# EAGLE schematic BrushlessLamp (EAGLE 9.6.2)
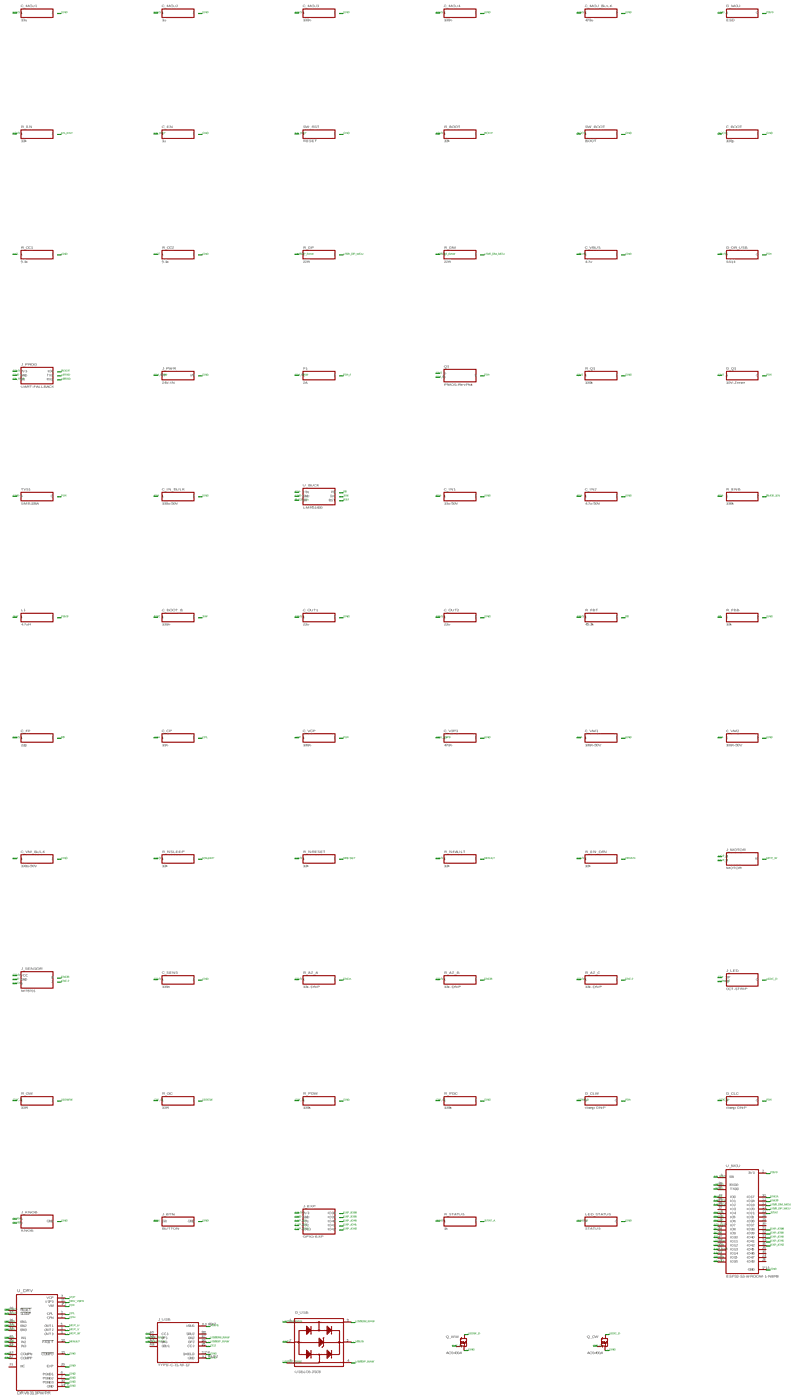
[diagram p0: schematic, sheet 1, overview]
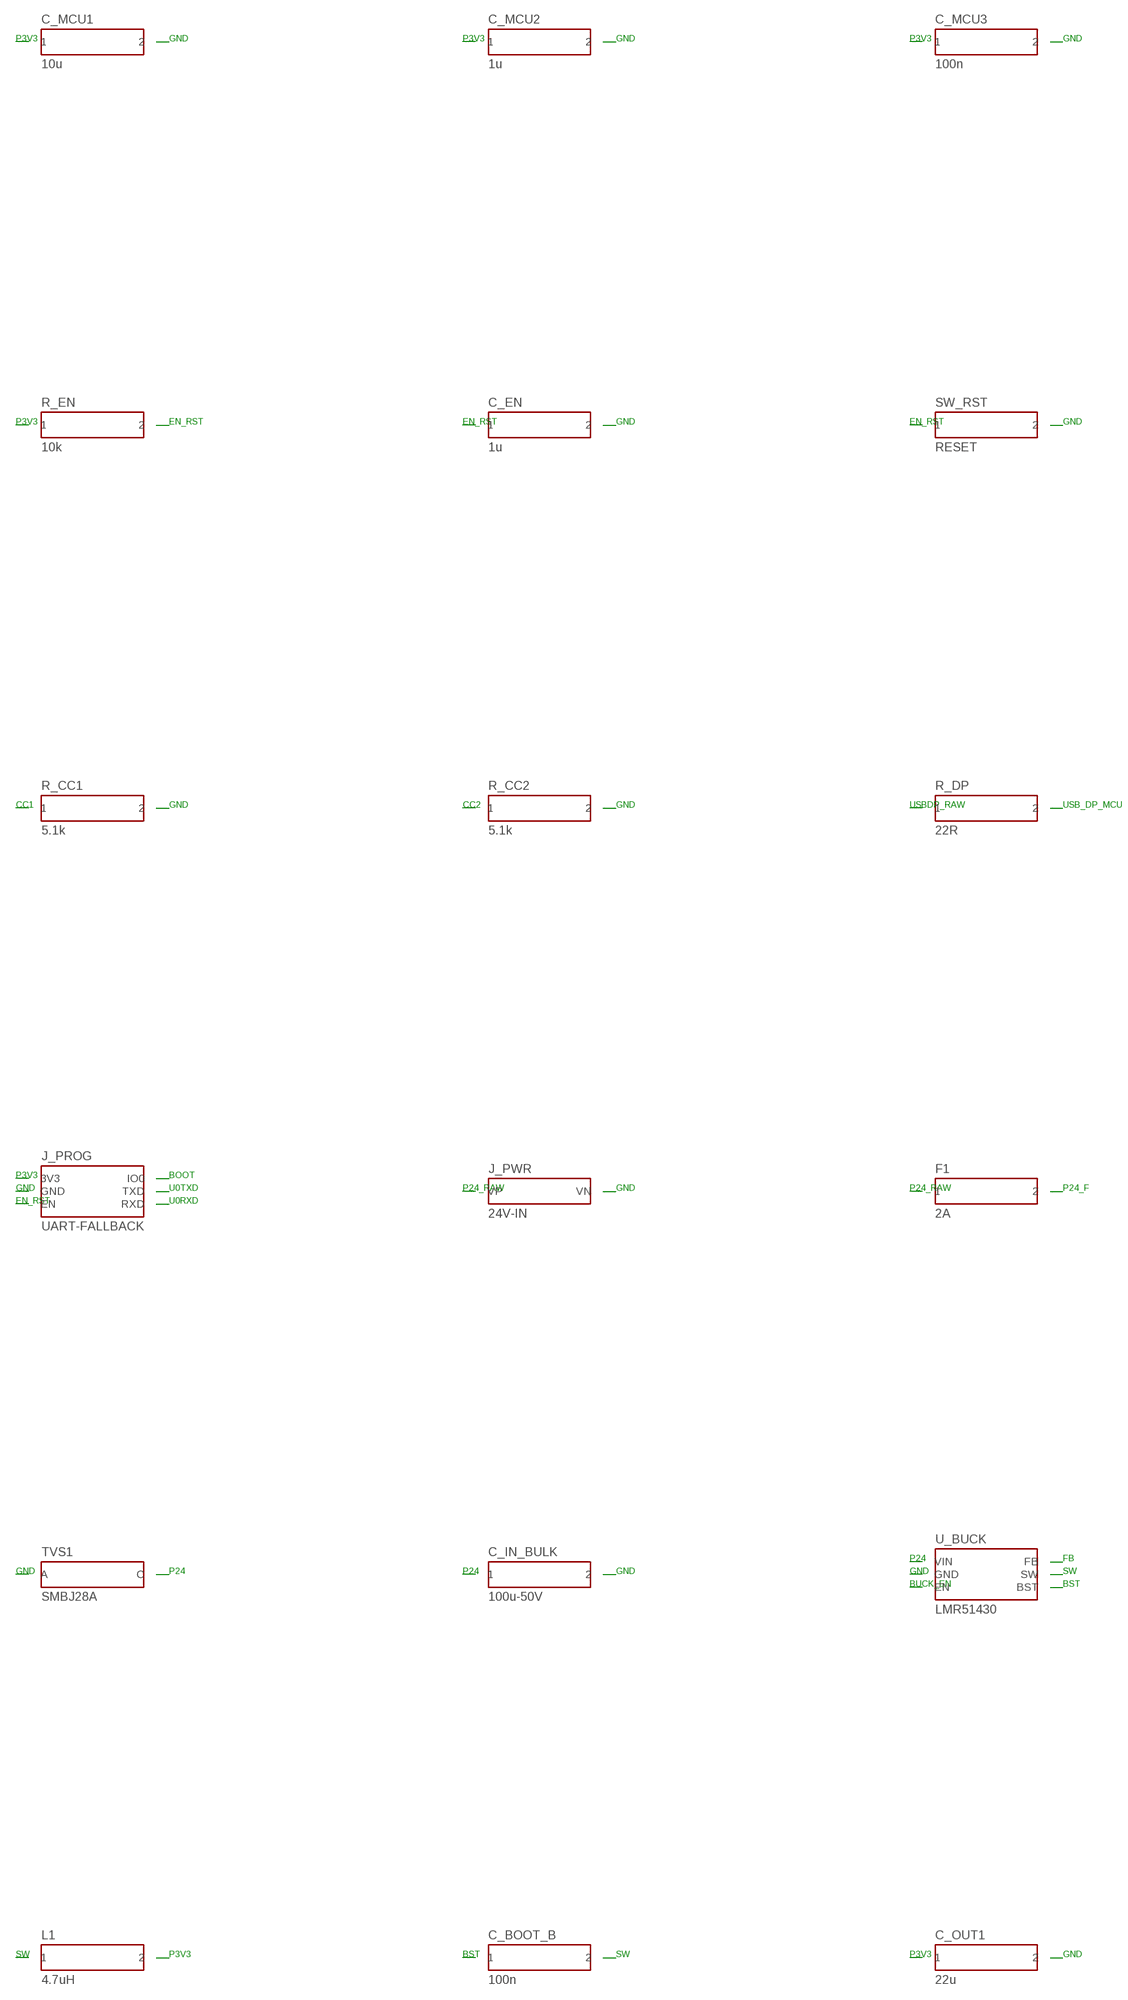
[diagram p1: schematic, sheet 1, part 1 of 4]
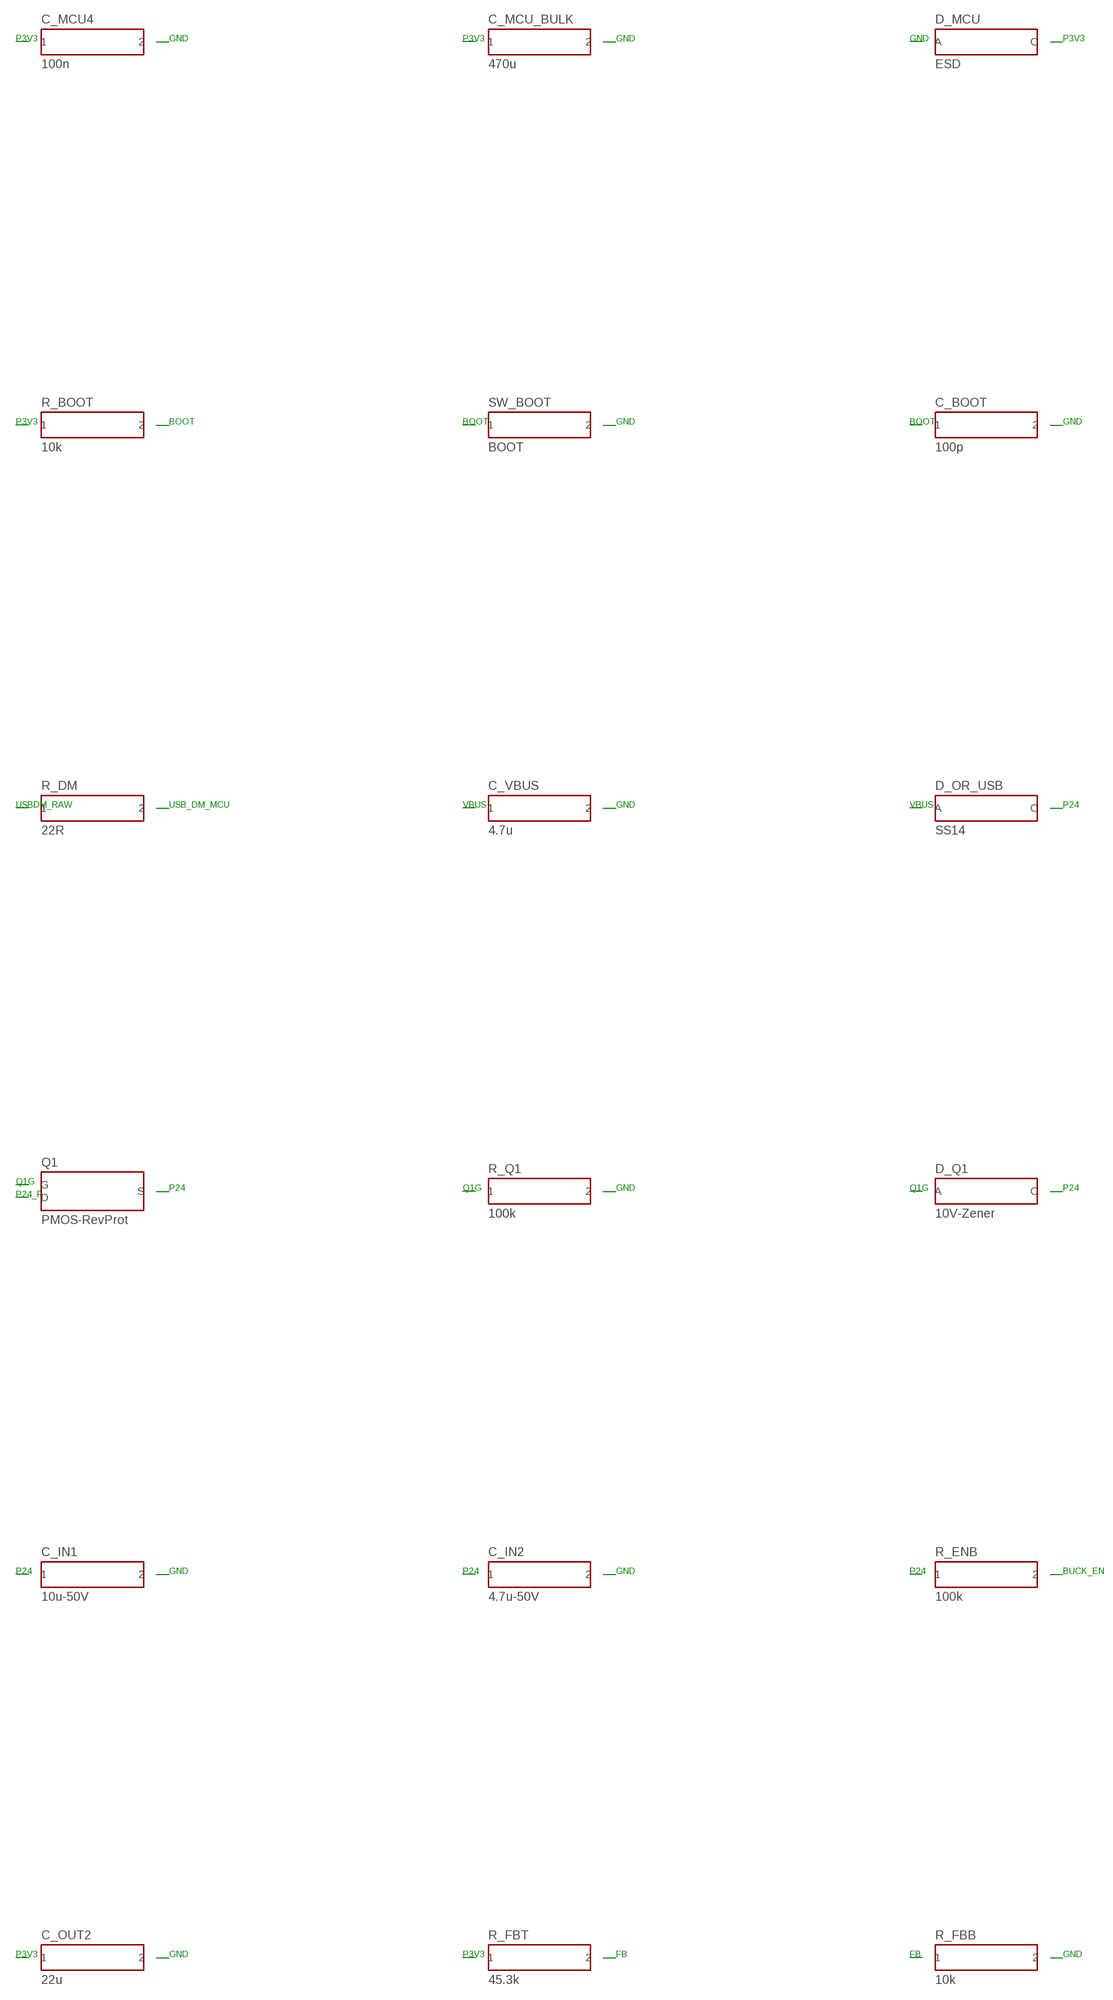
[diagram p2: schematic, sheet 1, part 2 of 4]
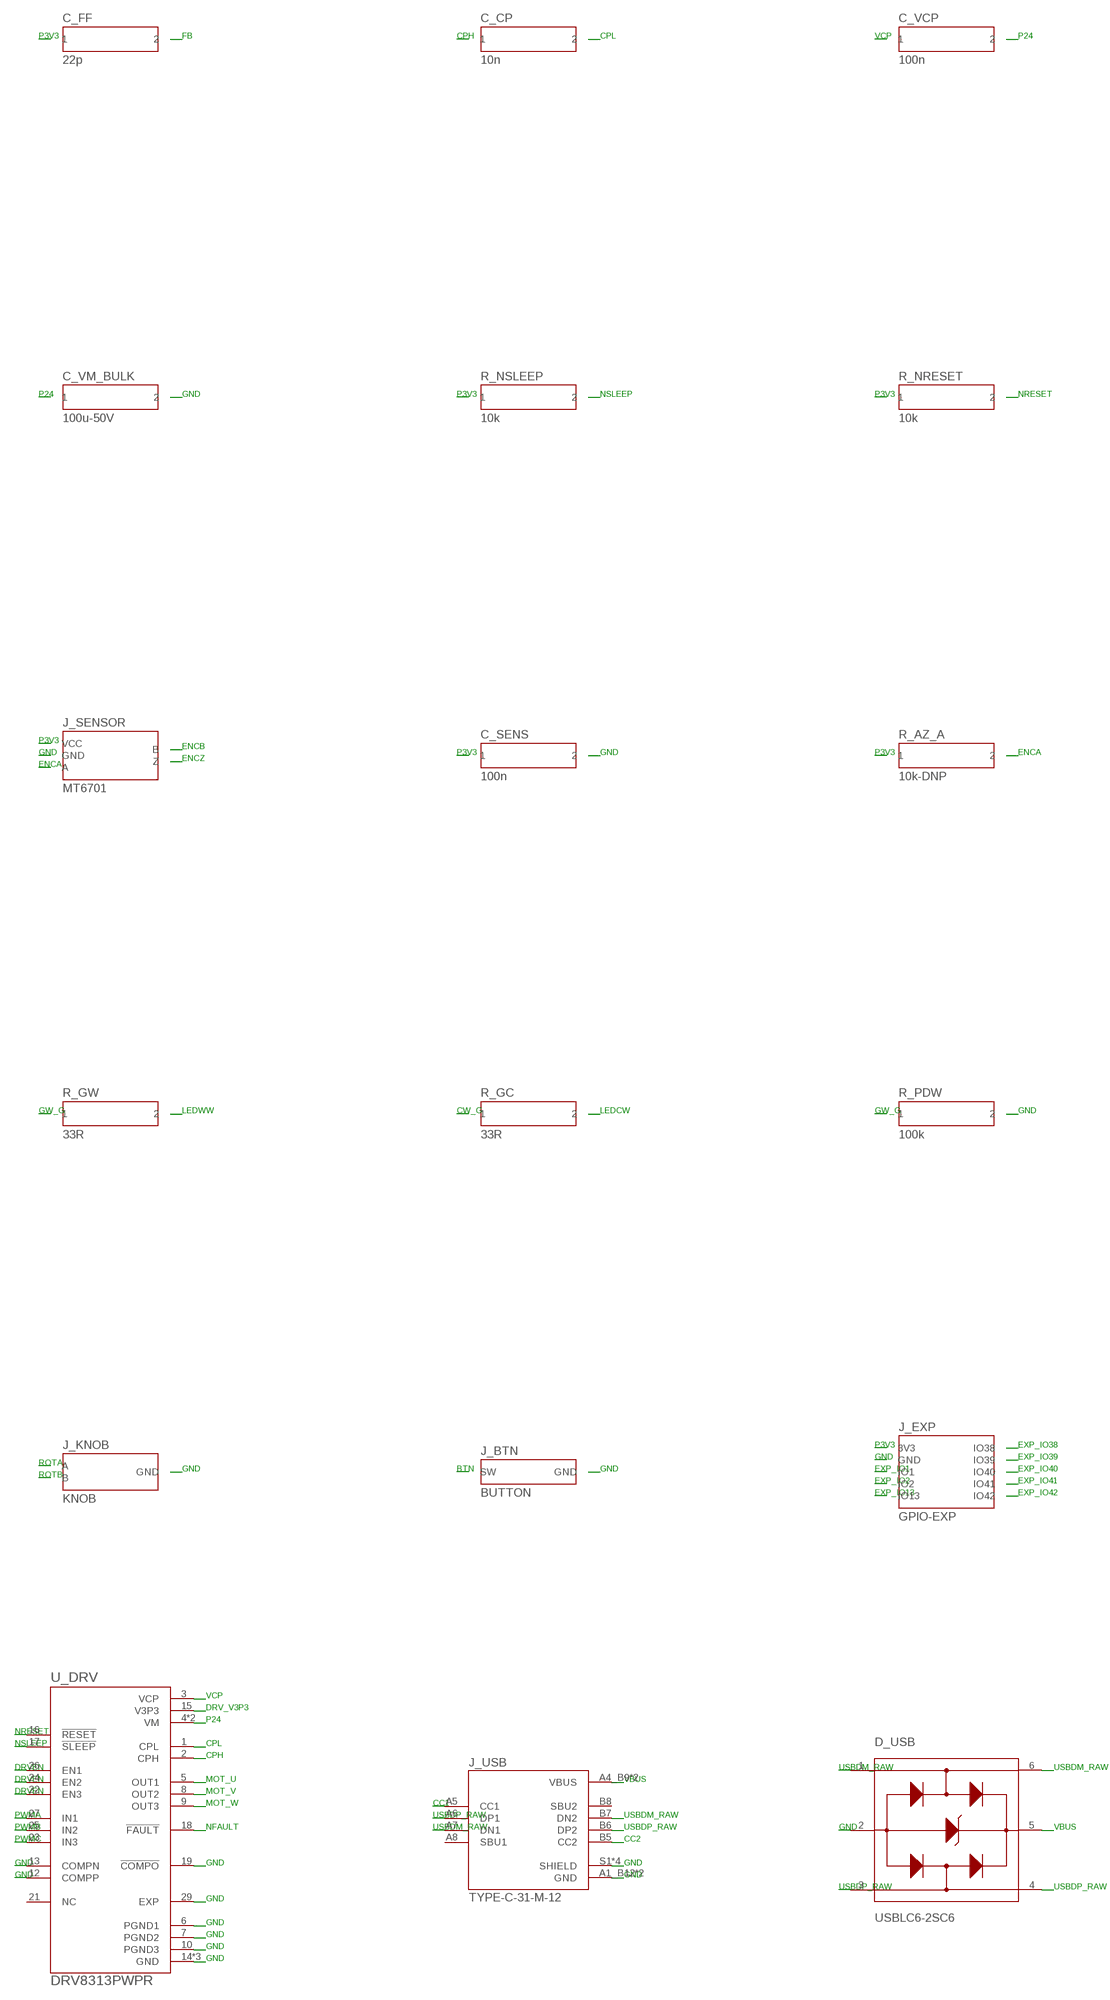
[diagram p3: schematic, sheet 1, part 3 of 4]
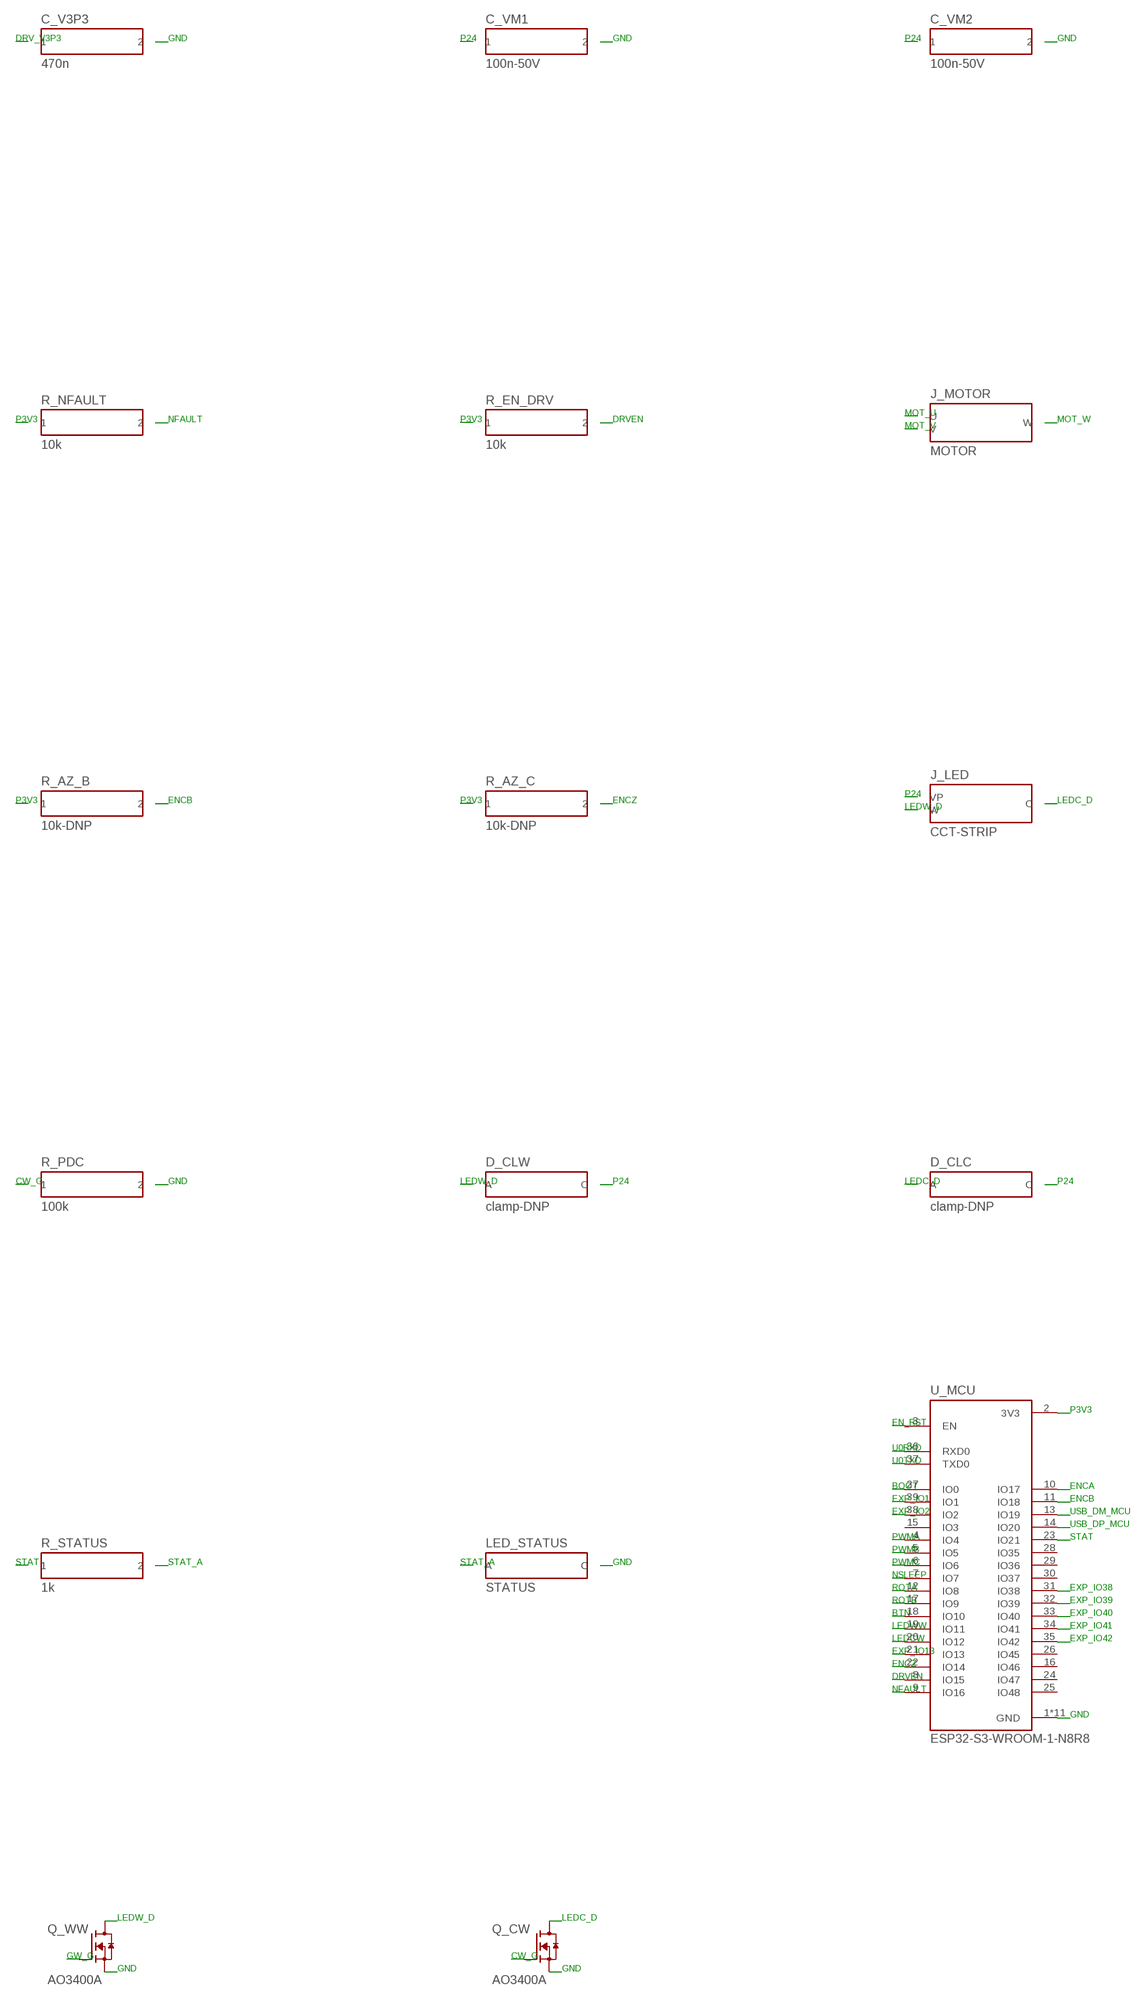
[diagram p4: schematic, sheet 1, part 4 of 4]

## Parts
C_BOOT  100p  CAP_0402  [0402]
C_BOOT_B  100n  CAP_0402  [0402]
C_CP  10n  CAP_0603  [0603]
C_EN  1u  CAP_0603  [0603]
C_FF  22p  CAP_0402  [0402]
C_IN1  10u-50V  CAP_1210  [1210]
C_IN2  4.7u-50V  CAP_1206  [1206]
C_IN_BULK  100u-50V  CAP_V  [CAP_V]
C_MCU1  10u  CAP_0805  [0805]
C_MCU2  1u  CAP_0603  [0603]
C_MCU3  100n  CAP_0402  [0402]
C_MCU4  100n  CAP_0402  [0402]
C_MCU_BULK  470u  CAP_D  [CAP_D]
C_OUT1  22u  CAP_0805  [0805]
C_OUT2  22u  CAP_0805  [0805]
C_SENS  100n  CAP_0402  [0402]
C_V3P3  470n  CAP_0603  [0603]
C_VBUS  4.7u  CAP_0603  [0603]
C_VCP  100n  CAP_0603  [0603]
C_VM1  100n-50V  CAP_0603  [0603]
C_VM2  100n-50V  CAP_0603  [0603]
C_VM_BULK  100u-50V  CAP_V  [CAP_V]
D_CLC  clamp-DNP  DIODE_SOD323  [SOD323]
D_CLW  clamp-DNP  DIODE_SOD323  [SOD323]
D_MCU  ESD  DIODE_SOD323  [SOD323]
D_OR_USB  SS14  DIODE_SMA  [SMA]
D_Q1  10V-Zener  DIODE_SOD123  [SOD123]
D_USB  USBLC6-2SC6  [SOT95P280X145-6N]
F1  2A  FUSE_NANO2  [FUSENANO2]
J_BTN  BUTTON  CONN_BTN_DS  [XH2]
J_EXP  GPIO-EXP  CONN_EXP_DS  [HDR10]
J_KNOB  KNOB  CONN_KNOB_DS  [XH3]
J_LED  CCT-STRIP  CONN_LED_DS  [XH3]
J_MOTOR  MOTOR  CONN_MOTOR_DS  [SCREW3]
J_PROG  UART-FALLBACK  CONN_PROG_DS  [HDR6]
J_PWR  24V-IN  CONN_PWR_DS  [SCREW2]
J_SENSOR  MT6701  CONN_SENSOR_DS  [SCREW5]
J_USB  TYPE-C-31-M-12  [HRO_TYPE-C-31-M-12]
L1  4.7uH  IND_SMD  [IND43]
LED_STATUS  STATUS  LED_0603  [LED0603]
Q1  PMOS-RevProt  FET_SOT23  [SOT23]
Q_CW  AO3400A  [SOT95P280X125-3N]
Q_WW  AO3400A  [SOT95P280X125-3N]
R_AZ_A  10k-DNP  RES_0603  [0603]
R_AZ_B  10k-DNP  RES_0603  [0603]
R_AZ_C  10k-DNP  RES_0603  [0603]
R_BOOT  10k  RES_0603  [0603]
R_CC1  5.1k  RES_0603  [0603]
R_CC2  5.1k  RES_0603  [0603]
R_DM  22R  RES_0603  [0603]
R_DP  22R  RES_0603  [0603]
R_EN  10k  RES_0603  [0603]
R_EN_DRV  10k  RES_0603  [0603]
R_ENB  100k  RES_0603  [0603]
R_FBB  10k  RES_0603  [0603]
R_FBT  45.3k  RES_0603  [0603]
R_GC  33R  RES_0603  [0603]
R_GW  33R  RES_0603  [0603]
R_NFAULT  10k  RES_0603  [0603]
R_NRESET  10k  RES_0603  [0603]
R_NSLEEP  10k  RES_0603  [0603]
R_PDC  100k  RES_0603  [0603]
R_PDW  100k  RES_0603  [0603]
R_Q1  100k  RES_0603  [0603]
R_STATUS  1k  RES_0603  [0603]
SW_BOOT  BOOT  SW_TACT  [TACT]
SW_RST  RESET  SW_TACT  [TACT]
TVS1  SMBJ28A  DIODE_SMB  [SMB]
U_BUCK  LMR51430  BUCK_DS  [SOT236]
U_DRV  DRV8313PWPR  [SOP65P640X120-29N]
U_MCU  ESP32-S3-WROOM-1-N8R8  [XCVR_ESP32S3WROOM1N8R8]

## Nets
BOOT: C_BOOT.1 J_PROG.4(IO0) R_BOOT.2 SW_BOOT.1 SW_BOOT.3 U_MCU.27(IO0)
BST: C_BOOT_B.1 U_BUCK.6(BST)
BTN: J_BTN.1(SW) U_MCU.18(IO10)
BUCK_EN: R_ENB.2 U_BUCK.5(EN)
CC1: J_USB.A5(CC1) R_CC1.1
CC2: J_USB.B5(CC2) R_CC2.1
CPH: C_CP.1 U_DRV.2(CPH)
CPL: C_CP.2 U_DRV.1(CPL)
CW_G: Q_CW.1(G) R_GC.1 R_PDC.1
DRV_V3P3: C_V3P3.1 U_DRV.15(V3P3)
DRVEN: R_EN_DRV.2 U_DRV.22(EN3) U_DRV.24(EN2) U_DRV.26(EN1) U_MCU.8(IO15)
EN_RST: C_EN.1 J_PROG.3(EN) R_EN.2 SW_RST.1 SW_RST.3 U_MCU.3(EN)
ENCA: J_SENSOR.3(A) R_AZ_A.2 U_MCU.10(IO17)
ENCB: J_SENSOR.4(B) R_AZ_B.2 U_MCU.11(IO18)
ENCZ: J_SENSOR.5(Z) R_AZ_C.2 U_MCU.22(IO14)
EXP_IO1: J_EXP.3(IO1) U_MCU.39(IO1)
EXP_IO2: J_EXP.4(IO2) U_MCU.38(IO2)
EXP_IO13: J_EXP.5(IO13) U_MCU.21(IO13)
EXP_IO38: J_EXP.6(IO38) U_MCU.31(IO38)
EXP_IO39: J_EXP.7(IO39) U_MCU.32(IO39)
EXP_IO40: J_EXP.8(IO40) U_MCU.33(IO40)
EXP_IO41: J_EXP.9(IO41) U_MCU.34(IO41)
EXP_IO42: J_EXP.10(IO42) U_MCU.35(IO42)
FB: C_FF.2 R_FBB.1 R_FBT.2 U_BUCK.4(FB)
GND: C_BOOT.2 C_EN.2 C_IN1.2 C_IN2.2 C_IN_BULK.2 C_MCU1.2 C_MCU2.2 C_MCU3.2 C_MCU4.2 C_MCU_BULK.2 C_OUT1.2 C_OUT2.2 C_SENS.2 C_V3P3.2 C_VBUS.2 C_VM1.2 C_VM2.2 C_VM_BULK.2 D_MCU.A D_USB.2(GND) J_BTN.2(GND) J_EXP.2(GND) J_KNOB.3(GND) J_PROG.2(GND) J_PWR.2(VN) J_SENSOR.2(GND) J_USB.A1_B12(GND) J_USB.B1_A12(GND) J_USB.S1(SHIELD) J_USB.S2(SHIELD) J_USB.S3(SHIELD) J_USB.S4(SHIELD) LED_STATUS.C Q_CW.2(S) Q_WW.2(S) R_CC1.2 R_CC2.2 R_FBB.2 R_PDC.2 R_PDW.2 R_Q1.2 SW_BOOT.2 SW_BOOT.4 SW_RST.2 SW_RST.4 TVS1.A U_BUCK.1(GND) U_DRV.6(PGND1) U_DRV.7(PGND2) U_DRV.10(PGND3) U_DRV.12(COMPP) U_DRV.13(COMPN) U_DRV.14(GND) U_DRV.19(!COMPO) U_DRV.20(GND) U_DRV.28(GND) U_DRV.29(EXP) U_MCU.1(GND) U_MCU.40(GND) U_MCU.41_1(GND) U_MCU.41_2(GND) U_MCU.41_3(GND) U_MCU.41_4(GND) U_MCU.41_5(GND) U_MCU.41_6(GND) U_MCU.41_7(GND) U_MCU.41_8(GND) U_MCU.41_9(GND)
GW_G: Q_WW.1(G) R_GW.1 R_PDW.1
LEDC_D: D_CLC.A J_LED.3(C) Q_CW.3(D)
LEDCW: R_GC.2 U_MCU.20(IO12)
LEDW_D: D_CLW.A J_LED.2(W) Q_WW.3(D)
LEDWW: R_GW.2 U_MCU.19(IO11)
MOT_U: J_MOTOR.1(U) U_DRV.5(OUT1)
MOT_V: J_MOTOR.2(V) U_DRV.8(OUT2)
MOT_W: J_MOTOR.3(W) U_DRV.9(OUT3)
NFAULT: R_NFAULT.2 U_DRV.18(!FAULT) U_MCU.9(IO16)
NRESET: R_NRESET.2 U_DRV.16(!RESET)
NSLEEP: R_NSLEEP.2 U_DRV.17(!SLEEP) U_MCU.7(IO7)
P3V3: C_FF.1 C_MCU1.1 C_MCU2.1 C_MCU3.1 C_MCU4.1 C_MCU_BULK.1 C_OUT1.1 C_OUT2.1 C_SENS.1 D_MCU.C J_EXP.1(3V3) J_PROG.1(3V3) J_SENSOR.1(VCC) L1.2 R_AZ_A.1 R_AZ_B.1 R_AZ_C.1 R_BOOT.1 R_EN.1 R_EN_DRV.1 R_FBT.1 R_NFAULT.1 R_NRESET.1 R_NSLEEP.1 U_MCU.2(3V3)
P24: C_IN1.1 C_IN2.1 C_IN_BULK.1 C_VCP.2 C_VM1.1 C_VM2.1 C_VM_BULK.1 D_CLC.C D_CLW.C D_OR_USB.C D_Q1.C J_LED.1(VP) Q1.2(S) R_ENB.1 TVS1.C U_BUCK.3(VIN) U_DRV.4(VM) U_DRV.11(VM)
P24_F: F1.2 Q1.3(D)
P24_RAW: F1.1 J_PWR.1(VP)
PWMA: U_DRV.27(IN1) U_MCU.4(IO4)
PWMB: U_DRV.25(IN2) U_MCU.5(IO5)
PWMC: U_DRV.23(IN3) U_MCU.6(IO6)
Q1G: D_Q1.A Q1.1(G) R_Q1.1
ROTA: J_KNOB.1(A) U_MCU.12(IO8)
ROTB: J_KNOB.2(B) U_MCU.17(IO9)
STAT: R_STATUS.1 U_MCU.23(IO21)
STAT_A: LED_STATUS.A R_STATUS.2
SW: C_BOOT_B.2 L1.1 U_BUCK.2(SW)
U0RXD: J_PROG.6(RXD) U_MCU.36(RXD0)
U0TXD: J_PROG.5(TXD) U_MCU.37(TXD0)
USB_DM_MCU: R_DM.2 U_MCU.13(IO19)
USB_DP_MCU: R_DP.2 U_MCU.14(IO20)
USBDM_RAW: D_USB.1(I/O1_IN) D_USB.6(I/O1_OUT) J_USB.A7(DN1) J_USB.B7(DN2) R_DM.1
USBDP_RAW: D_USB.3(I/O2_IN) D_USB.4(I/O2_OUT) J_USB.A6(DP1) J_USB.B6(DP2) R_DP.1
VBUS: C_VBUS.1 D_OR_USB.A D_USB.5(VBUS) J_USB.A4_B9(VBUS) J_USB.B4_A9(VBUS)
VCP: C_VCP.1 U_DRV.3(VCP)
Unconnected: J_USB.A8(SBU1) J_USB.B8(SBU2) U_DRV.21(NC) U_MCU.15(IO3) U_MCU.16(IO46) U_MCU.24(IO47) U_MCU.25(IO48) U_MCU.26(IO45) U_MCU.28(IO35) U_MCU.29(IO36) U_MCU.30(IO37)

## Library data of the parts
C_BOOT C_BOOT_B C_FF C_MCU3 C_MCU4 C_SENS = BLLIB:CAP_0402
C_CP C_EN C_MCU2 C_V3P3 C_VBUS C_VCP C_VM1 C_VM2 = BLLIB:CAP_0603
C_IN1 = BLLIB:CAP_1210
C_IN2 = BLLIB:CAP_1206
C_IN_BULK C_VM_BULK = BLLIB:CAP_V
C_MCU1 C_OUT1 C_OUT2 = BLLIB:CAP_0805
C_MCU_BULK = BLLIB:CAP_D
D_CLC D_CLW D_MCU = BLLIB:DIODE_SOD323
D_OR_USB = BLLIB:DIODE_SMA
D_Q1 = BLLIB:DIODE_SOD123
D_USB = USBLC6-2SC6:USBLC6-2SC6: Check availability <https://pricing.snapeda.com/parts/USBLC6-2SC6/STMicroelectronics/view-part?ref=eda>; Availability: In Stock; Check_prices: https://www.snapeda.com/parts/USBLC6-2SC6/STMicroelectronics/view-part/?ref=eda; Description: 17V Clamp 5A (8/20µs) Ipp Tvs Diode Surface Mount SOT-23-6; MF: STMicroelectronics; MP: USBLC6-2SC6; Package: SOT-23-6 STMicroelectronics; Price: None; Purchase-URL: https://www.snapeda.com/api/url_track_click_mouser/?unipart_id=231887&manufacturer=STMicroelectronics&part_name=USBLC6-2SC6&search_term= usblc6-2sc6; SnapEDA_Link: https://www.snapeda.com/parts/USBLC6-2SC6/STMicroelectronics/view-part/?ref=snap
F1 = BLLIB:FUSE_NANO2
J_BTN = BLLIB:CONN_BTN_DS
J_EXP = BLLIB:CONN_EXP_DS
J_KNOB = BLLIB:CONN_KNOB_DS
J_LED = BLLIB:CONN_LED_DS
J_MOTOR = BLLIB:CONN_MOTOR_DS
J_PROG = BLLIB:CONN_PROG_DS
J_PWR = BLLIB:CONN_PWR_DS
J_SENSOR = BLLIB:CONN_SENSOR_DS
J_USB = TYPE-C-31-M-12:TYPE-C-31-M-12: Check availability <https://pricing.snapeda.com/parts/TYPE-C-31-M-12/HRO%20Electronics%20Co.%2C%20Ltd./view-part?ref=eda>; Availability: Not in stock; Check_prices: https://www.snapeda.com/parts/TYPE-C-31-M-12/HRO+Electronics+Co.%252C+Ltd./view-part/?ref=eda; Description: USB Connectors 24 Receptacle 1 8.94*7.3mm RoHS; MF: HRO Electronics Co., Ltd.; MP: TYPE-C-31-M-12; Package: Package; Price: None; SnapEDA_Link: https://www.snapeda.com/parts/TYPE-C-31-M-12/HRO+Electronics+Co.%252C+Ltd./view-part/?ref=snap
L1 = BLLIB:IND_SMD
LED_STATUS = BLLIB:LED_0603
Q1 = BLLIB:FET_SOT23
Q_CW Q_WW = AO3400A:AO3400A: Check availability <https://pricing.snapeda.com/parts/AO3400A/UMW/view-part?ref=eda>; Availability: In Stock; Check_prices: https://www.snapeda.com/parts/AO3400A/UMW/view-part/?ref=eda; Description: N-Channel 30 V 5.8A (Ta) 1.4W (Ta) Surface Mount SOT-23; MF: UMW; MP: AO3400A; Package: None; Price: None; SnapEDA_Link: https://www.snapeda.com/parts/AO3400A/UMW/view-part/?ref=snap
R_AZ_A R_AZ_B R_AZ_C R_BOOT R_CC1 R_CC2 R_DM R_DP R_EN R_EN_DRV R_ENB R_FBB R_FBT R_GC R_GW R_NFAULT R_NRESET R_NSLEEP R_PDC R_PDW R_Q1 R_STATUS = BLLIB:RES_0603
SW_BOOT SW_RST = BLLIB:SW_TACT
TVS1 = BLLIB:DIODE_SMB
U_BUCK = BLLIB:BUCK_DS
U_DRV = DRV8313PWPR:DRV8313PWPR: Check availability <https://pricing.snapeda.com/parts/DRV8313PWPR/Texas%20Instruments/view-part?ref=eda>; Availability: In Stock; Check_prices: https://www.snapeda.com/parts/DRV8313PWPR/Texas+Instruments/view-part/?ref=eda; Description: 65-V max 3-A peak 3-phase motor driver with integrated FETs; MF: Texas Instruments; MP: DRV8313PWPR; Package: HTSSOP-28 Texas Instruments; Price: None; SnapEDA_Link: https://www.snapeda.com/parts/DRV8313PWPR/Texas+Instruments/view-part/?ref=snap
U_MCU = ESP32-S3-WROOM-1-N8R8:ESP32-S3-WROOM-1-N8R8: Check availability <https://pricing.snapeda.com/parts/ESP32-S3-WROOM-1-N8R8/Espressif%20Systems/view-part?ref=eda>; Availability: In Stock; Check_prices: https://www.snapeda.com/parts/ESP32-S3-WROOM-1-N8R8/Espressif+Systems/view-part/?ref=eda; Description: Bluetooth, WiFi 802.11b/g/n, Bluetooth v5.0 Transceiver Module 2.4GHz PCB Trace Surface Mount; MF: Espressif Systems; MP: ESP32-S3-WROOM-1-N8R8; Package: NON STANDARD Espressif Systems; Price: None; Purchase-URL: https://www.snapeda.com/api/url_track_click_mouser/?unipart_id=8936581&manufacturer=Espressif Systems&part_name=ESP32-S3-WROOM-1-N8R8&search_term= esp32-s3-wroom-1-n8r8; SnapEDA_Link: https://www.snapeda.com/parts/ESP32-S3-WROOM-1-N8R8/Espressif+Systems/view-part/?ref=snap